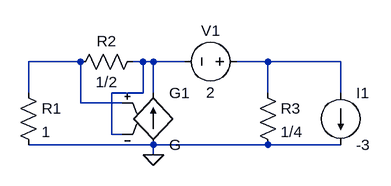
[diagram p0: schematic VCCS.asc]
VCCS.asc, the LTspice schematic file:
Version 4
SHEET 1 880 680
WIRE 128 80 48 80
WIRE 224 80 208 80
WIRE 240 80 224 80
WIRE 288 80 240 80
WIRE 416 80 368 80
WIRE 528 80 416 80
WIRE 48 128 48 80
WIRE 224 128 224 80
WIRE 224 128 176 128
WIRE 240 128 240 80
WIRE 416 128 416 80
WIRE 528 128 528 80
WIRE 128 144 128 80
WIRE 192 144 128 144
WIRE 176 192 176 128
WIRE 192 192 176 192
WIRE 240 208 48 208
WIRE 416 208 240 208
WIRE 528 208 416 208
WIRE 240 224 240 208
FLAG 240 224 0
SYMBOL res 32 112 R0
SYMATTR InstName R1
SYMATTR Value 1
SYMBOL res 224 64 R90
WINDOW 0 0 56 VBottom 2
WINDOW 3 32 56 VTop 2
SYMATTR InstName R2
SYMATTR Value 1/2
SYMBOL res 400 112 R0
SYMATTR InstName R3
SYMATTR Value 1/4
SYMBOL voltage 384 80 R90
WINDOW 0 -32 56 VBottom 2
WINDOW 3 32 56 VTop 2
WINDOW 123 0 0 Left 0
WINDOW 39 0 0 Left 0
SYMATTR InstName V1
SYMATTR Value 2
SYMBOL g 240 112 R0
SYMATTR InstName G1
SYMBOL current 528 128 R0
WINDOW 123 0 0 Left 0
WINDOW 39 0 0 Left 0
SYMATTR InstName I1
SYMATTR Value -3

The netlist it stands for:
* VCCS.asc
R1 N001 0 1
R2 N002 N001 1/2
R3 N003 0 1/4
V1 N003 N002 2
G1 0 N002 N001 N002 G
I1 N003 0 -3
.backanno
.end